# Altium schematic sheet TopLevel.SchDoc
size A4
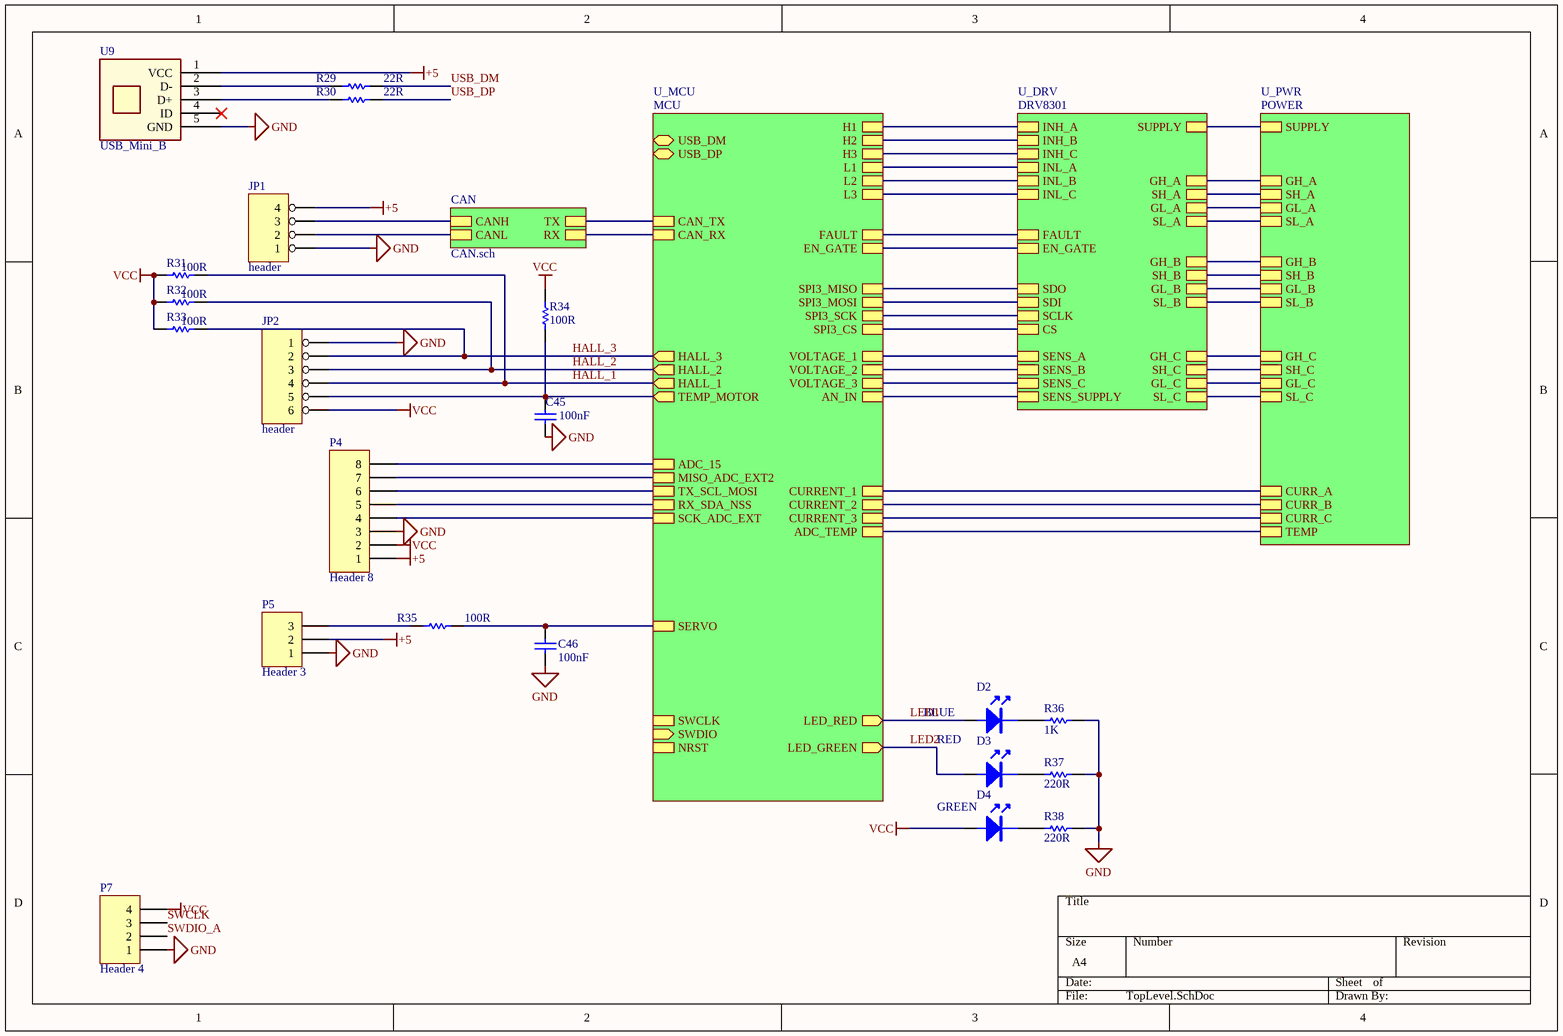
[diagram p0: TopLevel.SchDoc]

## Parts
C45  100nF  [0603-1]
C46  100nF  [0603-1]
D2  BLUE  [0603-1]
D3  RED  [0603-1]
D4  GREEN  [0603-1]
JP1  header  [HDR1X4]
JP2  header  [SMD-6]
P4  Header 8  [HDR1X8]
P5  Header 3  [HDR1X3]
P7  Header 4  [HDR1X4]
R29  22R  [0603-1]
R30  22R  [0603-1]
R31  100R  [0603-1]
R32  100R  [0603-1]
R33  100R  [0603-1]
R34  100R  [0603-1]
R35  100R  [0603-1]
R36  1K  [0603-1]
R37  220R  [0603-1]
R38  220R  [0603-1]
U9  USB_Mini_B  [Micro_USB]

## Sub-sheets
CAN = CAN.sch: TX, RX, CANH, CANL
U_DRV = DRV8301: INH_A, INH_B, INH_C, INL_A, INL_B, INL_C, FAULT, EN_GATE, SDO, SDI, SCLK, CS, SENS_A, SENS_B, SENS_C, SENS_SUPPLY, SUPPLY, GH_A, SH_A, GL_A, SL_A, GH_B, SH_B, GL_B, SL_B, SL_C, GL_C, SH_C, GH_C
U_MCU = MCU: USB_DM (bidir), USB_DP (bidir), CAN_TX, CAN_RX, HALL_3 (out), HALL_2 (out), HALL_1 (out), TEMP_MOTOR (out), ADC_15, MISO_ADC_EXT2, RX_SDA_NSS, TX_SCL_MOSI, SCK_ADC_EXT, SERVO, NRST, SWDIO (in), SWCLK, H1, H2, H3, L1, L2, L3, FAULT, EN_GATE, SPI3_MISO, SPI3_MOSI, SPI3_SCK, SPI3_CS, VOLTAGE_1, VOLTAGE_2, VOLTAGE_3, AN_IN, CURRENT_1, CURRENT_2, CURRENT_3, ADC_TEMP, LED_RED (out), LED_GREEN (out)
U_PWR = POWER: SUPPLY, GH_A, SH_A, GL_A, SL_A, GH_B, SH_B, GL_B, SL_B, GH_C, SH_C, GL_C, SL_C, TEMP, CURR_C, CURR_B, CURR_A

## Nets
+5: JP1.4 P4.1 P5.2 U9.1(VCC)
GND: C45.2 C46.2 JP1.1 JP2.1 P4.3 P5.1 P7.1 R36.2 R37.2 R38.2 U9.5(GND)
VCC: D4.1(A) JP2.6 P4.2 P7.4 R31.2 R32.2 R33.2 R34.1
HALL_1: JP2.4 R31.1 ; sheet U_MCU/HALL_1
HALL_2: JP2.3 R32.1 ; sheet U_MCU/HALL_2
HALL_3: JP2.2 R33.1 ; sheet U_MCU/HALL_3
LED1: D2.1(A) ; sheet U_MCU/LED_RED
LED2: D3.1(A) ; sheet U_MCU/LED_GREEN
SWCLK: P7.3
SWDIO_A: P7.2
USB_DM: R29.2
USB_DP: R30.2
NetC45_1: C45.1 JP2.5 R34.2 ; sheet U_MCU/TEMP_MOTOR
NetC46_1: C46.1 R35.2 ; sheet U_MCU/SERVO
NetD2_2: D2.2(K) R36.1
NetD3_2: D3.2(K) R37.1
NetD4_2: D4.2(K) R38.1
NetJP1_2: JP1.2 ; sheet CAN/CANL
NetJP1_3: JP1.3 ; sheet CAN/CANH
NetP4_4: P4.4 ; sheet U_MCU/SCK_ADC_EXT
NetP4_5: P4.5 ; sheet U_MCU/RX_SDA_NSS
NetP4_6: P4.6 ; sheet U_MCU/TX_SCL_MOSI
NetP4_7: P4.7 ; sheet U_MCU/MISO_ADC_EXT2
NetP4_8: P4.8 ; sheet U_MCU/ADC_15
NetP5_3: P5.3 R35.1
NetR29_1: R29.1 U9.2(D-)
NetR30_1: R30.1 U9.3(D+)
(unnamed): sheet U_MCU/CAN_TX, sheet CAN/TX
(unnamed): sheet U_MCU/CAN_RX, sheet CAN/RX
(unnamed): sheet U_MCU/H1, sheet U_DRV/INH_A
(unnamed): sheet U_MCU/H2, sheet U_DRV/INH_B
(unnamed): sheet U_MCU/H3, sheet U_DRV/INH_C
(unnamed): sheet U_MCU/L1, sheet U_DRV/INL_A
(unnamed): sheet U_MCU/L2, sheet U_DRV/INL_B
(unnamed): sheet U_MCU/L3, sheet U_DRV/INL_C
(unnamed): sheet U_MCU/FAULT, sheet U_DRV/FAULT
(unnamed): sheet U_MCU/EN_GATE, sheet U_DRV/EN_GATE
(unnamed): sheet U_MCU/SPI3_MISO, sheet U_DRV/SDO
(unnamed): sheet U_MCU/SPI3_MOSI, sheet U_DRV/SDI
(unnamed): sheet U_MCU/SPI3_SCK, sheet U_DRV/SCLK
(unnamed): sheet U_MCU/SPI3_CS, sheet U_DRV/CS
(unnamed): sheet U_MCU/VOLTAGE_1, sheet U_DRV/SENS_A
(unnamed): sheet U_MCU/VOLTAGE_2, sheet U_DRV/SENS_B
(unnamed): sheet U_MCU/VOLTAGE_3, sheet U_DRV/SENS_C
(unnamed): sheet U_MCU/AN_IN, sheet U_DRV/SENS_SUPPLY
(unnamed): sheet U_MCU/CURRENT_1, sheet U_PWR/CURR_A
(unnamed): sheet U_MCU/CURRENT_2, sheet U_PWR/CURR_B
(unnamed): sheet U_MCU/CURRENT_3, sheet U_PWR/CURR_C
(unnamed): sheet U_MCU/ADC_TEMP, sheet U_PWR/TEMP
(unnamed): sheet U_DRV/SUPPLY, sheet U_PWR/SUPPLY
(unnamed): sheet U_DRV/GH_A, sheet U_PWR/GH_A
(unnamed): sheet U_DRV/SH_A, sheet U_PWR/SH_A
(unnamed): sheet U_DRV/GL_A, sheet U_PWR/GL_A
(unnamed): sheet U_DRV/SL_A, sheet U_PWR/SL_A
(unnamed): sheet U_DRV/GH_B, sheet U_PWR/GH_B
(unnamed): sheet U_DRV/SH_B, sheet U_PWR/SH_B
(unnamed): sheet U_DRV/GL_B, sheet U_PWR/GL_B
(unnamed): sheet U_DRV/SL_B, sheet U_PWR/SL_B
(unnamed): sheet U_DRV/SL_C, sheet U_PWR/SL_C
(unnamed): sheet U_DRV/GL_C, sheet U_PWR/GL_C
(unnamed): sheet U_DRV/SH_C, sheet U_PWR/SH_C
(unnamed): sheet U_DRV/GH_C, sheet U_PWR/GH_C

Not connected (* = marked no-connect by the designer): U9 4(ID)*

## Library data of the parts
C45 C46 = CAP: Capacitor; Value: 104; Published: 8-Jun-2000; LatestRevisionDate: 17-Jul-2002; LatestRevisionNote: Re-released for DXP Platform.; PackageReference: RAD-0.3; Publisher: Altium Limited
D2-D4 = LED: LED 发光二极管
JP1 = HEADER 4
JP2 = HEADER 6
P4 = Header 8: Header, 8-Pin; LatestRevisionDate: 17-Jul-2002; LatestRevisionNote: Re-released for DXP Platform.; Publisher: Altium Limited
P5 = Header 3: Header, 3-Pin; LatestRevisionDate: 17-Jul-2002; LatestRevisionNote: Re-released for DXP Platform.; Publisher: Altium Limited
P7 = Header 4: Header, 4-Pin; LatestRevisionDate: 17-Jul-2002; LatestRevisionNote: Re-released for DXP Platform.; Publisher: Altium Limited
R29-R35 R37 R38 = RES: Resistor; Value: 1K; Published: 8-Jun-2000; Revision: July-2002: Re-released for DXP Platform.; Publisher: Altium Limited
R36 = RES: Resistor; Published: 8-Jun-2000; Revision: July-2002: Re-released for DXP Platform.; Publisher: Altium Limited; Value: 1K
U9 = USB_Mini_B: Model: 54819-0578; OrderNr: 418-0172; Maker: Molex; Distributor: RS; Price: 4,29 (5)